# Altium schematic sheet 02-Power.SchDoc: ECE315 Analog
size A; Date: 4/25/2017; ApprovedBy: JSK; CheckedBy: JSK; Author: JSK; CompanyName: University of Wisconsin; DrawnBy: JSK; Engineer: JSK; Organization: ECE 315; Address1: College of Engineering; Address2: 1415 Engineering Drive; Address3: Madison, WI 53706; Address4: ECE 315 Fall 2017; Revision: A; SheetNumber: 2; SheetTotal: 2; AssemblyNumber: ECE315-F19; ApprovedDate: 04/02/2019
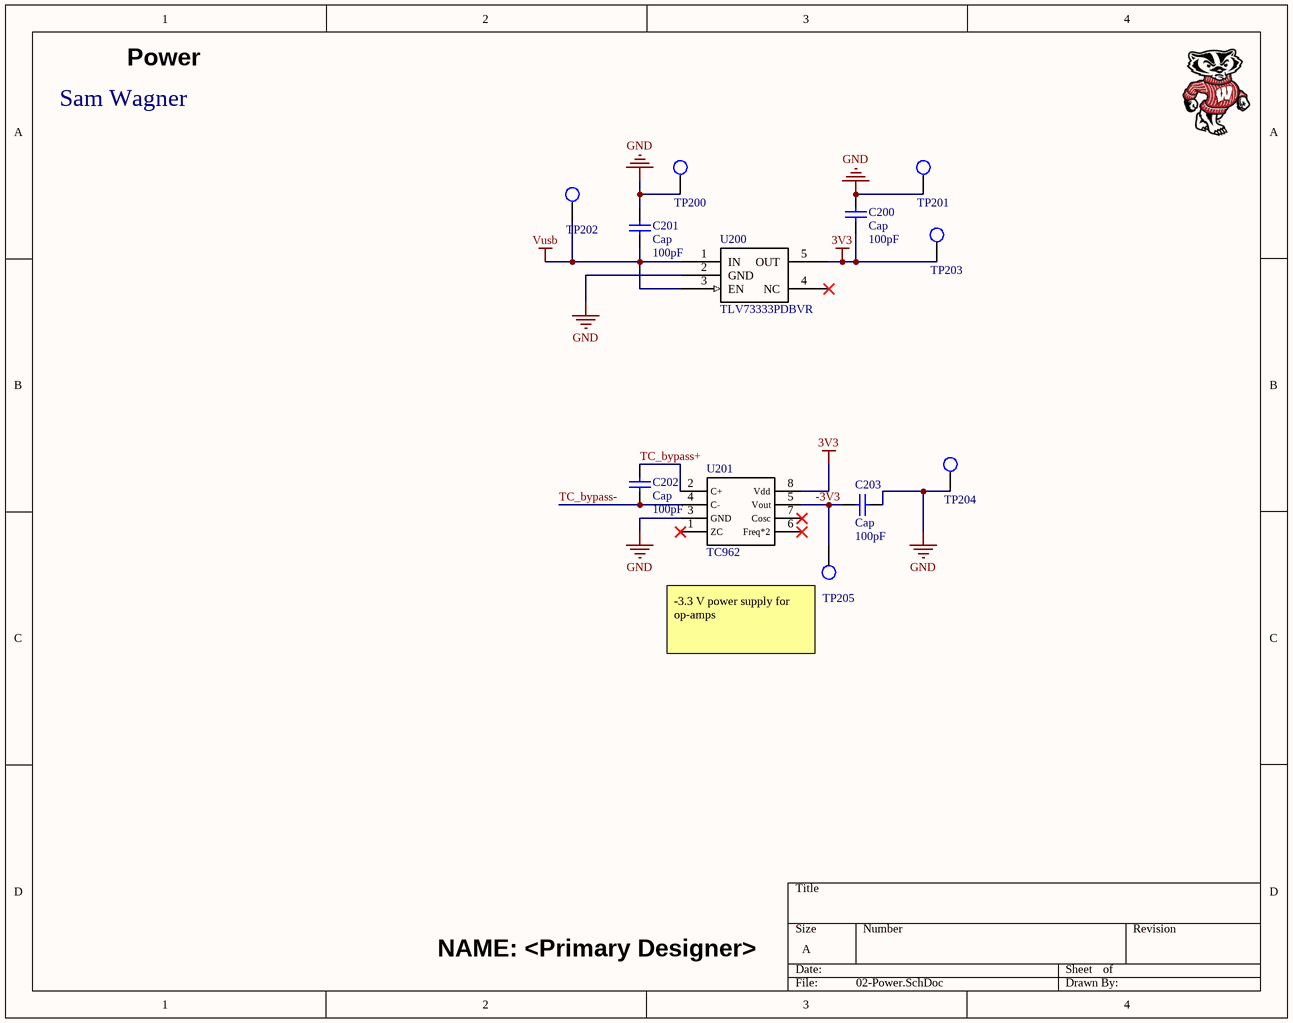
[diagram p0: 02-Power.SchDoc]

## Parts
C200  Cap  value 100pF  [RAD-0.3]
C201  Cap  value 100pF  [RAD-0.3]
C202  Cap  value 100pF  [RAD-0.3]
C203  Cap  value 100pF  [RAD-0.3]
TP200  TP_1206  [TP-SMC-1206]  (value not drawn)
TP201  TP_1206  [TP-SMC-1206]  (value not drawn)
TP202  TP_1206  [TP-SMC-1206]  (value not drawn)
TP203  TP_1206  [TP-SMC-1206]  (value not drawn)
TP204  TP_1206  [TP-SMC-1206]  (value not drawn)
TP205  TP_1206  [TP-SMC-1206]  (value not drawn)
U200  Manufacturer Part Number: TLV73333PDBVR  [IC_TLV73333]  (hidden comment: IC-TLV733P)
U201  TC962  [DIP8]

## Nets
3V3: C200.2 TP203.1 U200.5(OUT) U201.8(Vdd)
GND: C200.1 C201.2 C203.1 TP200.1 TP201.1 TP204.1 U200.2(GND) U201.3(GND)
Vusb: C201.1 TP202.1 U200.1(IN) U200.3(EN)
-3V3: C203.2 TP205.1 U201.5(Vout)
TC_bypass+: C202.1 U201.2(C+)
TC_bypass-: C202.2 U201.4(C-)

Not connected (* = marked no-connect by the designer): U200 4(NC)*; U201 1(ZC)* 6(Freq*2)* 7(Cosc)*

## Notes on the sheet
- Power
- Sam Wagner
- (near TP205) -3.3 V power supply for op-amps
- NAME: <Primary Designer>

## Library data of the parts
C200-C203 = Cap: Capacitor; Published: 8-Jun-2000; LatestRevisionDate: 17-Jul-2002; LatestRevisionNote: Re-released for DXP Platform.; PackageReference: RAD-0.3; Publisher: Altium Limited; PackageDescription: Radial Cap, Thru-Hole; 2 Leads; 0.3 in Pin Spacing
TP200-TP205 = TP_1206: Test Point SMD 1206; Manufacturer: TE Connectivity (Tyco Electronics); Manufacturer Part Number: 1625854-1; Resistance Value: 0 Ohm; Temperature Coefficient: N/R; Supplier 1: Digi-Key; Stock 1: 31937; Pricing 1: 1=0.28, 10=0.261, 25=0.224, 50=0.1902, 100=0.1828, 250=0.1641, 500=0.1567, 1000=0.1306 (USD); Case Size: 1206; Dimension: 3.2 x 1.6 x 1.25mm; Family: RC; Mounting: Surface Mount; Operating Temperature: -55 to 125 C; Part No: 1625854-1; RoHS: Yes; Packaging: Tape and Reel; Termination Style: N/R; Terminal Pitch: N/R; Power Rating: N/R; Tolerance: N/R; ComponentLink1URL: https://datasheet.ciiva.com/6439/eng-ds-1773266-a-6439169.pdf; ComponentLink1Description: https://datasheet.ciiva.com/6439/eng-ds-1773266-a-6439169.pdf; ComponentLink2URL: https://datasheet.ciiva.com/30136/1773266-a-30136341.pdf; ComponentLink2Description: https://datasheet.ciiva.com/30136/1773266-a-30136341.pdf; ComponentLink3URL: https://datasheet.ciiva.com/6439/eng-ds-1773266-a-6439080.pdf; ComponentLink3Description: https://datasheet.ciiva.com/6439/eng-ds-1773266-a-6439080.pdf; ComponentLink4URL: https://datasheet.ciiva.com/6439/eng-ds-1773266-a-6439081.pdf; ComponentLink4Description: https://datasheet.ciiva.com/6439/eng-ds-1773266-a-6439081.pdf; ComponentLink5URL: https://datasheet.ciiva.com/6439/eng-ds-1773266-a-6439083.pdf; ComponentLink5Description: https://datasheet.ciiva.com/6439/eng-ds-1773266-a-6439083.pdf; Supplier Part Number 1: A106143CT-ND
U200 = IC-TLV733P: IC REG LINEAR 3.3V 300MA SOT23-5; Manufacturer: Texas Instruments; Number of Outputs: 1; Min Input Voltage: 1.4V; Max Input Voltage: 5.5V; Dropout Voltage: 125mV; Min Current Limit: 360mA; Polarity: Positive; Quiescent Current: 60uA; Accuracy: 1%; Supplier 1: Digi-Key; Stock 1: 44968; Pricing 1: 1=0.46, 10=0.373, 100=0.2538, 500=0.19034, 1000=0.14276 (USD); Mount: Surface Mount; Case/Package: SOT-23-5; Number of Pins: 5; Weight: 0.000557oz; Contact Plating: Nickel,Gold; Min Operating Temperature: -40°C; Packaging: Tape and Reel; Max Output Current: 300mA; Output Voltage: 3.3V; Output Current: 300mA; Number of Regulators: 1; Package Quantity: 3000; Radiation Hardening: No; ComponentLink1URL: https://datasheet.ciiva.com/48677/tlv733p-48677542.pdf; ComponentLink1Description: https://datasheet.ciiva.com/48677/tlv733p-48677542.pdf; Supplier Part Number 1: 296-40673-1-ND; Manufactor Part Number: TLV73333PDBVR; Max Operating Temperature: 125°C; Lead Free: Lead Free
U201 = TC962: Supplier 1: Digi-Key; Supplier Part Number 1: TC962CPA-ND